# EAGLE schematic power (EAGLE 9.6.2)
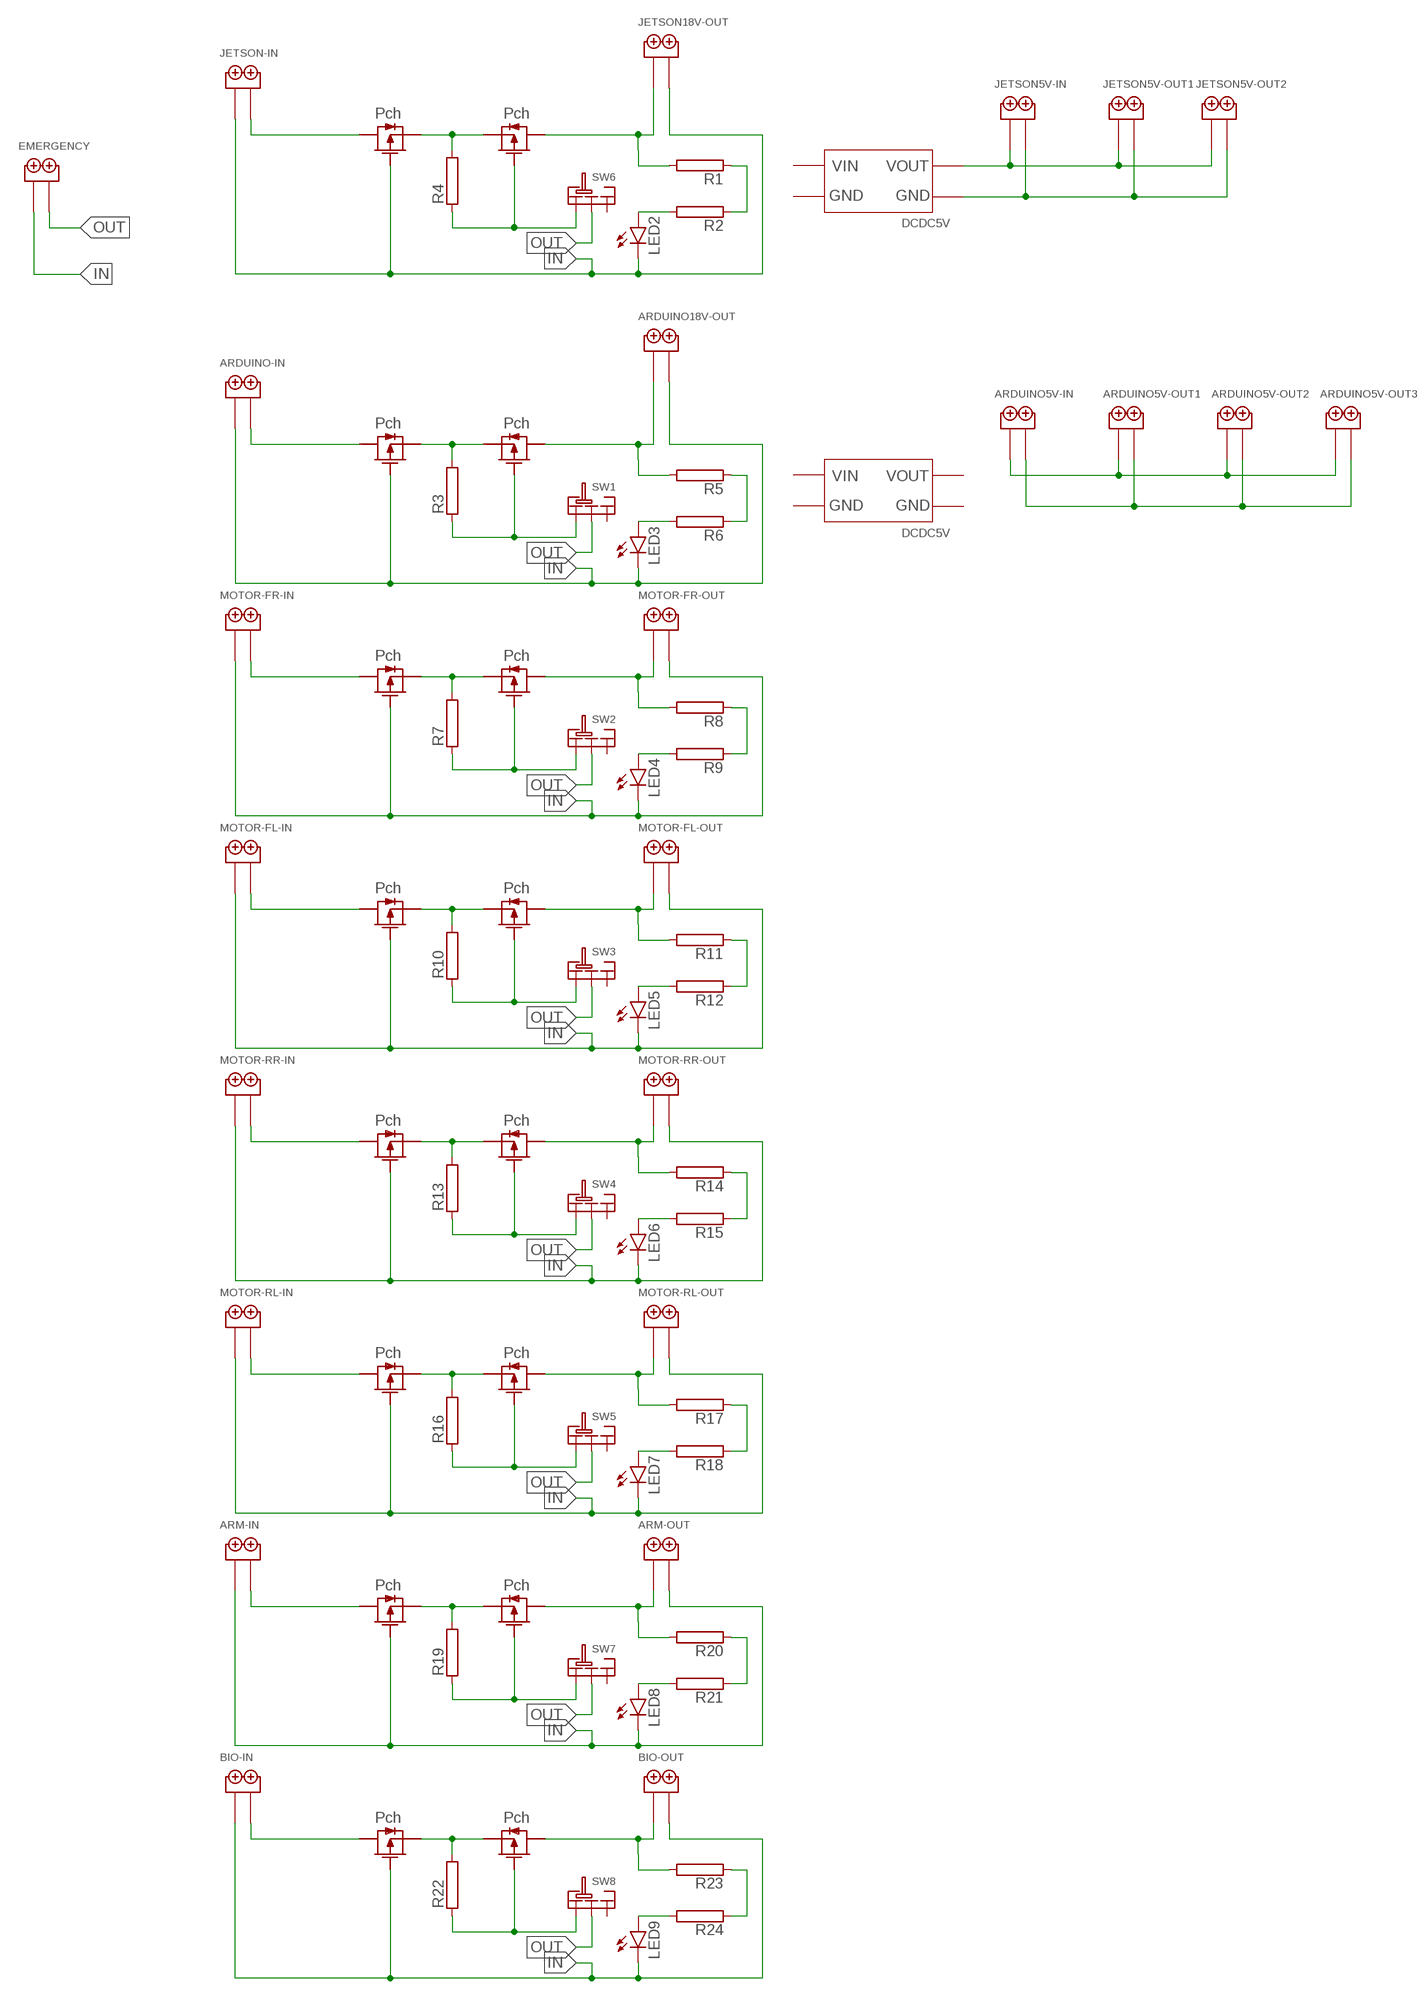
[diagram p0: schematic, sheet 1]

## Parts
ARDUINO5V-IN  2PIN  [2PIN]
ARDUINO5V-OUT1  2PIN  [2PIN]
ARDUINO5V-OUT2  2PIN  [2PIN]
ARDUINO5V-OUT3  2PIN  [2PIN]
ARDUINO18V-OUT  2PIN  [2PIN]
ARDUINO-IN  2PIN  [2PIN]
ARM-IN  2PIN  [2PIN]
ARM-OUT  2PIN  [2PIN]
BIO-IN  2PIN  [2PIN]
BIO-OUT  2PIN  [2PIN]
EMERGENCY  2PIN  [2PIN]
JETSON5V-IN  2PIN  [2PIN]
JETSON5V-OUT1  2PIN  [2PIN]
JETSON5V-OUT2  2PIN  [2PIN]
JETSON18V-OUT  2PIN  [2PIN]
JETSON-IN  2PIN  [2PIN]
LED2  LED5MM  [LED5MM]
LED3  LED5MM  [LED5MM]
LED4  LED5MM  [LED5MM]
LED5  LED5MM  [LED5MM]
LED6  LED5MM  [LED5MM]
LED7  LED5MM  [LED5MM]
LED8  LED5MM  [LED5MM]
LED9  LED5MM  [LED5MM]
MOTOR-FL-IN  2PIN  [2PIN]
MOTOR-FL-OUT  2PIN  [2PIN]
MOTOR-FR-IN  2PIN  [2PIN]
MOTOR-FR-OUT  2PIN  [2PIN]
MOTOR-RL-IN  2PIN  [2PIN]
MOTOR-RL-OUT  2PIN  [2PIN]
MOTOR-RR-IN  2PIN  [2PIN]
MOTOR-RR-OUT  2PIN  [2PIN]
R1  RAC01  [AC01]
R2  RAC01  [AC01]
R3  RAC01  [AC01]
R4  RAC01  [AC01]
R5  RAC01  [AC01]
R6  RAC01  [AC01]
R7  RAC01  [AC01]
R8  RAC01  [AC01]
R9  RAC01  [AC01]
R10  RAC01  [AC01]
R11  RAC01  [AC01]
R12  RAC01  [AC01]
R13  RAC01  [AC01]
R14  RAC01  [AC01]
R15  RAC01  [AC01]
R16  RAC01  [AC01]
R17  RAC01  [AC01]
R18  RAC01  [AC01]
R19  RAC01  [AC01]
R20  RAC01  [AC01]
R21  RAC01  [AC01]
R22  RAC01  [AC01]
R23  RAC01  [AC01]
R24  RAC01  [AC01]
SW1  SRIDE_SWITCH  [SRIDE_SWITCH]
SW2  SRIDE_SWITCH  [SRIDE_SWITCH]
SW3  SRIDE_SWITCH  [SRIDE_SWITCH]
SW4  SRIDE_SWITCH  [SRIDE_SWITCH]
SW5  SRIDE_SWITCH  [SRIDE_SWITCH]
SW6  SRIDE_SWITCH  [SRIDE_SWITCH]
SW7  SRIDE_SWITCH  [SRIDE_SWITCH]
SW8  SRIDE_SWITCH  [SRIDE_SWITCH]
U$1  2SJ334  [2SJ334]
U$2  DCDCDEV  [DCDCDEV]
U$3  2SJ334  [2SJ334]
U$4  2SJ334  [2SJ334]
U$5  2SJ334  [2SJ334]
U$7  2SJ334  [2SJ334]
U$8  2SJ334  [2SJ334]
U$10  2SJ334  [2SJ334]
U$11  2SJ334  [2SJ334]
U$13  2SJ334  [2SJ334]
U$14  2SJ334  [2SJ334]
U$16  2SJ334  [2SJ334]
U$17  2SJ334  [2SJ334]
U$20  2SJ334  [2SJ334]
U$21  2SJ334  [2SJ334]
U$23  DCDCDEV  [DCDCDEV]
U$24  2SJ334  [2SJ334]
U$25  2SJ334  [2SJ334]

## Nets
18V [power]: JETSON-IN.P$2 U$3.DRAIN
IN: ARDUINO18V-OUT.P$2 ARDUINO-IN.P$1 ARM-IN.P$1 ARM-OUT.P$2 BIO-IN.P$1 BIO-OUT.P$2 EMERGENCY.P$1 JETSON18V-OUT.P$2 JETSON-IN.P$1 LED2.K(C) LED3.K(C) LED4.K(C) LED5.K(C) LED6.K(C) LED7.K(C) LED8.K(C) LED9.K(C) MOTOR-FL-IN.P$1 MOTOR-FL-OUT.P$2 MOTOR-FR-IN.P$1 MOTOR-FR-OUT.P$2 MOTOR-RL-IN.P$1 MOTOR-RL-OUT.P$2 MOTOR-RR-IN.P$1 MOTOR-RR-OUT.P$2 U$1.GATE U$3.GATE U$7.GATE U$10.GATE U$13.GATE U$16.GATE U$20.GATE U$24.GATE
MA [power]: R4.2 U$3.SOURCE U$4.SOURCE
MAC [power]: JETSON18V-OUT.P$1 R1.2 U$4.DRAIN
MAD [power]: JETSON5V-IN.P$1 JETSON5V-OUT1.P$1 JETSON5V-OUT2.P$1
MBB [power]: ARDUINO-IN.P$2 U$1.DRAIN
MBV [power]: R13.2 U$13.SOURCE U$14.SOURCE
MCX [power]: R16.2 U$16.SOURCE U$17.SOURCE
MDSDS [power]: BIO-IN.P$2 U$24.DRAIN
MGG [power]: ARM-IN.P$2 U$20.DRAIN
MH [power]: R10.2 U$10.SOURCE U$11.SOURCE
MHGF [power]: ARM-OUT.P$1 R20.2 U$21.DRAIN
MHH [power]: MOTOR-RR-OUT.P$1 R14.2 U$14.DRAIN
MHHHH [power]: BIO-OUT.P$1 R23.2 U$25.DRAIN
MJUY [power]: R22.2 U$24.SOURCE U$25.SOURCE
MKK [power]: R3.2 U$1.SOURCE U$5.SOURCE
ML [power]: ARDUINO5V-IN.P$1 ARDUINO5V-OUT1.P$1 ARDUINO5V-OUT2.P$1 ARDUINO5V-OUT3.P$1
MN [power]: MOTOR-RL-IN.P$2 U$16.DRAIN
MOO [power]: ARDUINO18V-OUT.P$1 R5.2 U$5.DRAIN
MS [power]: R7.2 U$7.SOURCE U$8.SOURCE
MU [power]: MOTOR-FR-IN.P$2 U$7.DRAIN
MV [power]: MOTOR-FL-OUT.P$1 R11.2 U$11.DRAIN
MVVV [power]: R19.2 U$20.SOURCE U$21.SOURCE
MX [power]: MOTOR-RR-IN.P$2 U$13.DRAIN
MY [power]: MOTOR-FL-IN.P$2 U$10.DRAIN
MZZ [power]: MOTOR-RL-OUT.P$1 R17.2 U$17.DRAIN
N$1: R3.1 SW1.L U$5.GATE
N$2: LED2.A R2.2
N$3: LED3.A R6.2
N$4: LED4.A R9.2
N$6: R5.1 R6.1
N$7: LED5.A R12.2
N$8: R22.1 SW8.L U$25.GATE
N$9 [power]: ARDUINO5V-IN.P$2 ARDUINO5V-OUT1.P$2 ARDUINO5V-OUT2.P$2 ARDUINO5V-OUT3.P$2
N$10: R7.1 SW2.L U$8.GATE
N$11: LED6.A R15.2
N$12: LED7.A R18.2
N$13 [power]: MOTOR-FR-OUT.P$1 R8.2 U$8.DRAIN
N$15: R8.1 R9.1
N$16: LED8.A R21.2
N$17: LED9.A R24.2
N$18 [power]: JETSON5V-IN.P$2 JETSON5V-OUT1.P$2 JETSON5V-OUT2.P$2
N$19: R10.1 SW3.L U$11.GATE
N$24: R11.1 R12.1
N$28: R13.1 SW4.L U$14.GATE
N$33: R14.1 R15.1
N$37: R16.1 SW5.L U$17.GATE
N$42: R17.1 R18.1
N$43: R4.1 SW6.L U$4.GATE
N$49: R1.1 R2.1
N$52: R19.1 SW7.L U$21.GATE
N$58: R23.1 R24.1
N$60: R20.1 R21.1
OUT: EMERGENCY.P$2 SW1.LR SW2.LR SW3.LR SW4.LR SW5.LR SW6.LR SW7.LR SW8.LR
Unconnected: SW1.R SW2.R SW3.R SW4.R SW5.R SW6.R SW7.R SW8.R

## Library data of the parts
ARDUINO5V-IN ARDUINO5V-OUT1-ARDUINO5V-OUT3 ARDUINO18V-OUT ARDUINO-IN ARM-IN ARM-OUT BIO-IN BIO-OUT EMERGENCY JETSON5V-IN JETSON5V-OUT1 JETSON5V-OUT2 JETSON18V-OUT JETSON-IN MOTOR-FL-IN MOTOR-FL-OUT MOTOR-FR-IN MOTOR-FR-OUT MOTOR-RL-IN MOTOR-RL-OUT MOTOR-RR-IN MOTOR-RR-OUT = TB113-2B-x-x-0-x-x:2PIN
LED2-LED9 = led:LED: LED OSRAM: - CHIPLED LG R971, LG N971, LY N971, LG Q971, LY Q971, LO R971, LY R971 LH N974, LH R974 LS Q976, LO Q976, LY Q976 LO Q996 - Hyper CHIPLED LW Q18S LB Q993, LB Q99A, LB R99A - SideLED LS A670, LO A670, LY A670, LG A670, LP A670 LB A673, LV A673, LT A673, LW A673 LH A674 LY A675 LS A676, LA A676, LO A676, LY A676, LW A676 LS A679, LY A679, LG A679 - Hyper Micro SIDELED® LS Y876, LA Y876, LO Y876, LY Y876 LT Y87S - SmartLED LW L88C, LW L88S LB L89C, LB L89S, LG L890 LS L89K, LO L89K, LY L89K LS L896, LA L896, LO L896, LY L896 - TOPLED LS T670, LO T670, LY T670, LG T670, LP T670 LSG T670, LSP T670, LSY T670, LOP T670, LYG T670 LG T671, LOG T671, LSG T671 LB T673, LV T673, LT T673, LW T673 LH T674 LS T676, LA T676, LO T676, LY T676, LB T676, LH T676, LSB T676, LW T676 LB T67C, LV T67C, LT T67C, LS T67K, LO T67K, LY T67K, LW E67C LS E67B, LA E67B, LO E67B, LY E67B, LB E67C, LV E67C, LT E67C LW T67C LS T679, LY T679, LG T679 LS T770, LO T770, LY T770, LG T770, LP T770 LB T773, LV T773, LT T773, LW T773 LH T774 LS E675, LA E675, LY E675, LS T675 LS T776, LA T776, LO T776, LY T776, LB T776 LHGB T686 LT T68C, LB T68C - Hyper Mini TOPLED® LB M676 - Mini TOPLED Santana® LG M470 LS M47K, LO M47K, LY M47K Source: http://www.osram.convergy.de LUXEON: - LUMILED® LXK2-PW12-R00, LXK2-PW12-S00, LXK2-PW14-U00, LXK2-PW14-V00 LXK2-PM12-R00, LXK2-PM12-S00, LXK2-PM14-U00 LXK2-PE12-Q00, LXK2-PE12-R00, LXK2-PE12-S00, LXK2-PE14-T00, LXK2-PE14-U00 LXK2-PB12-K00, LXK2-PB12-L00, LXK2-PB12-M00, LXK2-PB14-N00, LXK2-PB14-P00, LXK2-PB14-Q00 LXK2-PR12-L00, LXK2-PR12-M00, LXK2-PR14-Q00, LXK2-PR14-R00 LXK2-PD12-Q00, LXK2-PD12-R00, LXK2-PD12-S00 LXK2-PH12-R00, LXK2-PH12-S00 LXK2-PL12-P00, LXK2-PL12-Q00, LXK2-PL12-R00 Source: www.luxeon.com KINGBRIGHT: KA-3528ASYC Source: www.kingbright.com
R1-R24 = resistor-power:R: Power Resitor; OC_FARNELL: unknown; OC_NEWARK: unknown
SW1-SW8 = Sride Switch:SRIDE_SWITCH
U$1 U$3-U$5 U$7 U$8 U$10 U$11 U$13 U$14 U$16 U$17 U$20 U$21 U$24 U$25 = 2SJ334:2SJ334
U$2 U$23 = dcdcDEVkit:DCDCDEV

## Net classes
0 default: width 0.762 mm
1 power: width 2.54 mm, clearance 0.127 mm